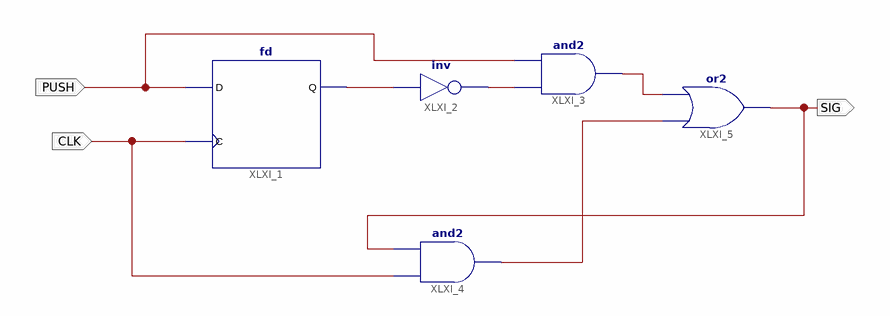
[diagram p0: schematic sheet 1]
// Xilinx ISE schematic clock_signal.sch (spartan3e) as structural Verilog: 5 symbols, 3 ports
module clock_signal (
  input  PUSH,
  input  CLK,
  output SIG
);

  wire XLXN_1, XLXN_5, XLXN_8, XLXN_9;

  fd XLXI_1 (.C(CLK), .D(PUSH), .Q(XLXN_1));
  not XLXI_2 (XLXN_8, XLXN_1);
  and XLXI_3 (XLXN_9, XLXN_8, PUSH);
  and XLXI_4 (XLXN_5, CLK, SIG);
  or XLXI_5 (SIG, XLXN_5, XLXN_9);
endmodule
